# Altium project noise_toaster.PrjPcb (part 1 of 3)
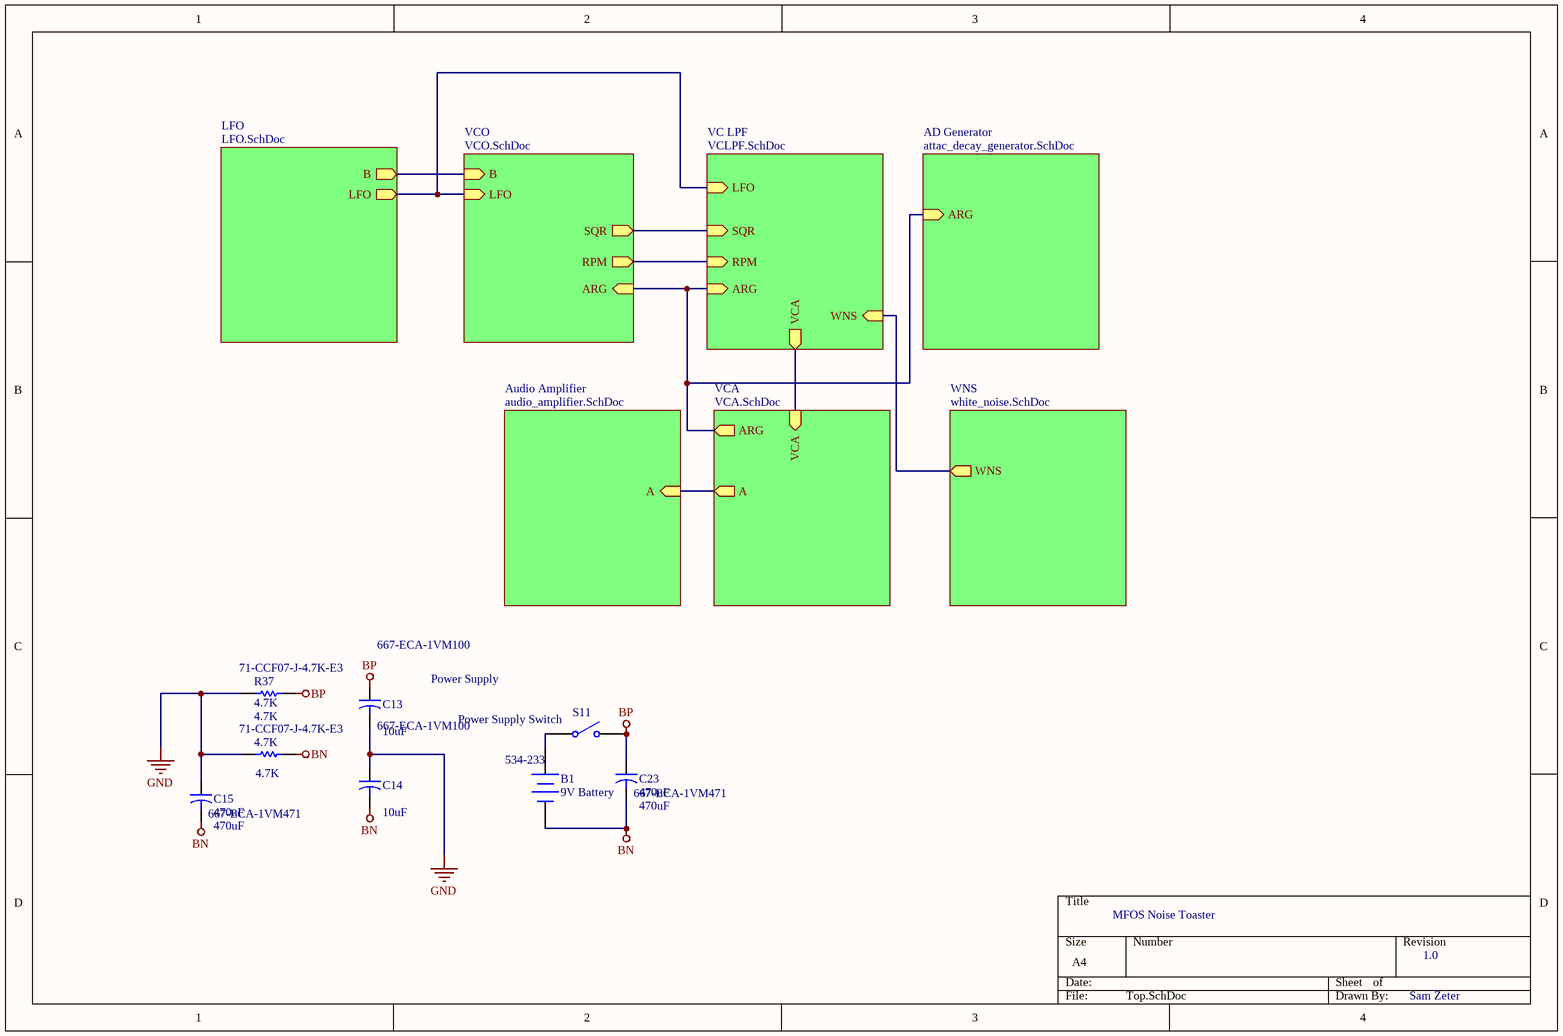
[diagram p0: Top.SchDoc]
8 sheets, 155 parts. Net scope: hierarchical (ports join the sheet entries above them; power ports are global).
Board file: main.PcbDoc
Sheets:
  Top.SchDoc
    VCO = VCO.SchDoc
    VCA = VCA.SchDoc
    VC LPF = VCLPF.SchDoc
    LFO = LFO.SchDoc
    AD Generator = attac_decay_generator.SchDoc
    Audio Amplifier = audio_amplifier.SchDoc
    WNS = white_noise.SchDoc

## Sheet Top.SchDoc
size A4

### Parts
4.7K  value 4.7K  Supplier Part Number 1: 71-CCF07-J-4.7K-E3  [AXIAL-0.3]  (hidden comment: Res1)
B1  9V Battery  Supplier Part Number 1: 534-233  [BAT-2]
C13  Supplier Part Number 1: 667-ECA-1VM100  [CAPR5-4X5]  (hidden comment: 10uF)
C14  Supplier Part Number 1: 667-ECA-1VM100  [CAPR5-4X5]  (hidden comment: 10uF)
C15  470uF  Supplier Part Number 1: 667-ECA-1VM471  [CAPR5-4X5]
C23  470uF  Supplier Part Number 1: 667-ECA-1VM471  [CAPR5-4X5]
R37  4.7K  Supplier Part Number 1: 71-CCF07-J-4.7K-E3  [AXIAL-0.3]
S11  Power Supply Switch  [SPST-2]

### Sub-sheets
AD Generator = attac_decay_generator.SchDoc: ARG (in)
Audio Amplifier = audio_amplifier.SchDoc: A (in)
LFO = LFO.SchDoc: LFO (out), B (out)
VC LPF = VCLPF.SchDoc: LFO (in), RPM (in), SQR (in), WNS (in), ARG (in), VCA (out)
VCA = VCA.SchDoc: VCA (in), A (out), ARG (out)
VCO = VCO.SchDoc: LFO (in), B (in), SQR (out), RPM (out), ARG (in)
WNS = white_noise.SchDoc: WNS (out)

### Nets
BN: 4.7K.2 B1.2(-) C14.2 C15.2 C23.2
BP: C13.1 C23.1 R37.2 S11.2(NO)
GND: 4.7K.1 C13.2 C14.1 C15.1 R37.1
NetB1_1: B1.1(+) S11.1(COMMON)
NetC2_1: sheet VCO/RPM, sheet VC LPF/RPM
NetC10_2: sheet VCA/VCA, sheet VC LPF/VCA
NetC17_2: sheet VCO/B, sheet LFO/B
NetQ6_3: sheet VC LPF/WNS, sheet WNS/WNS
NetQ7_2: sheet VCA/A, sheet Audio Amplifier/A
NetQ9_2: sheet VCO/ARG, sheet VCA/ARG, sheet VC LPF/ARG, sheet AD Generator/ARG
NetR13_1: sheet VCO/LFO, sheet VC LPF/LFO, sheet LFO/LFO
NetR31_2: sheet VCO/SQR, sheet VC LPF/SQR

### Notes on the sheet
- Power Supply
- MFOS Noise Toaster
- 1.0
- Sam Zeter

### Library data of the parts
4.7K R37 = Res1: Resistor; Manufacturer: Vishay / Dale; Manufacturer Part Number: CCF074K70JKE36; Power Rating: 250 mW (1/4 W), 500 mW (1/2 W); Resistance: 4.7 kOhms; Temperature Coefficient: 100 PPM / K; Tolerance: 5 %; Voltage Rating: 250 V; Lead Diameter: 0.6 mm; Published: 8-Jun-2000; LatestRevisionDate: 17-Jul-2002; LatestRevisionNote: Re-released for DXP Platform.; PackageReference: AXIAL-0.3; Publisher: Altium Limited; PackageDescription: Axial Device, Thru-Hole; 2 Leads; 0.3 in Pin Spacing; Supplier 1: Mouser; RoHS: RoHS Compliant; Category: Metal Film Resistors - Through Hole; Stock 1: 32326; Pricing 1: 1=0.100, 100=0.040, 1000=0.030, 2000=0.027, 5000=0.025, 10000=0.022, 25000=0.020, 50000=0.018, 100000=0.016 (USD); Diameter: 2.29 mm; Length: 6.22 mm; Operating Temperature Range: - 65 C to + 150 C; Packaging: Reel; Product: Metal Film Resistors - Through Hole; Series: CCF07; Termination Style: Axial; Type: Metal Film Resistors, Industrial; Brand: Vishay / Dale; Standard Pack Qty: 5000; RoHS - Mouser: Y; Minimum Order Quantity: 1; Reeling: True; ComponentLink1URL: http://www.mouser.com/ds/2/427/ccf07-239748.pdf; ComponentLink1Description: http://www.mouser.com/ds/2/427/ccf07-239748.pdf
  R37: Value: 4.7K
B1 = Battery: Multicell Battery; Manufacturer: Keystone Electronics; Manufacturer Part Number: 233; Number of Batteries: 1 Battery; Published: 24-Mar-1999; LatestRevisionDate: 17-Jul-2002; LatestRevisionNote: Re-released for DXP Platform.; PackageReference: BAT-2; Publisher: Altium Limited; PackageDescription: Battery; 2 Leads; Supplier 1: Mouser; RoHS: RoHS Compliant; Category: 9V Battery Snaps & Contacts; Stock 1: 3397; Pricing 1: 1=0.490, 10=0.467, 50=0.374, 100=0.358, 200=0.327, 500=0.312, 1000=0.259, 2500=0.234, 5000=0.226 (USD); Contact Plating: Nickel Plating; Material: Brass; Packaging: Bulk; Product: Battery Snaps; Type: Battery Strap; Battery Cell Size: 9 V; Brand: Keystone Electronics; Standard Pack Qty: 100; RoHS - Mouser: Y; Minimum Order Quantity: 1; Reeling: False; ComponentLink1URL: http://www.mouser.com/ds/2/215/32-234-741101.pdf; ComponentLink1Description: http://www.mouser.com/ds/2/215/32-234-741101.pdf
C13 C14 = Cap2: Capacitor; Manufacturer: Panasonic; Manufacturer Part Number: ECA-1VM100; Tolerance: 20 %; Type: Radial Lead Type; Voltage Rating DC: 35 VDC; Life: 2000 Hour; Ripple Current: 60 mA; Published: 23-Sep-2002; PackageReference: CAPR5-4X5; Publisher: Altium Limited; PackageDescription: Capacitor; 2 Leads; Value: 10uF; Supplier 1: Mouser; RoHS: RoHS Compliant; Category: Aluminum Electrolytic Capacitors - Leaded; Stock 1: 30530; Pricing 1: 1=0.200, 10=0.080, 100=0.055, 500=0.046, 1000=0.041, 2500=0.039, 10000=0.030, 25000=0.028, 50000=0.025 (USD); Capacitance: 10 uF; Diameter: 5 mm; Length: 11 mm; Package / Case: Radial, Can; Packaging: Bulk; Product: General Purpose Electrolytic Capacitors; Series: M; Termination Style: Radial; Brand: Panasonic; Lead Spacing: 2 mm; Lead Style: Straight; Maximum Operating Temperature: + 85 C; Minimum Operating Temperature: - 40 C; Standard Pack Qty: 200; RoHS - Mouser: Y; Minimum Order Quantity: 1; Reeling: False; ComponentLink1URL: http://www.mouser.com/ds/2/315/ABA0000C1047-947484.pdf; ComponentLink1Description: http://www.mouser.com/ds/2/315/ABA0000C1047-947484.pdf
C15 C23 = Cap2: Capacitor; Manufacturer: Panasonic; Manufacturer Part Number: ECA-1VM471; Tolerance: 20 %; Type: Radial Lead Type; Voltage Rating DC: 35 VDC; Dissipation Factor DF: 0.14; Life: 2000 Hour; Ripple Current: 550 mA; Published: 23-Sep-2002; PackageReference: CAPR5-4X5; Publisher: Altium Limited; PackageDescription: Capacitor; 2 Leads; Value: 470uF; Supplier 1: Mouser; RoHS: RoHS Compliant; Category: Aluminum Electrolytic Capacitors - Leaded; Stock 1: 25570; Pricing 1: 1=0.470, 10=0.252, 100=0.187, 500=0.162, 1000=0.138, 2500=0.130, 10000=0.112, 25000=0.110, 50000=0.104 (USD); Capacitance: 470 uF; Diameter: 10 mm; Length: 16 mm; Package / Case: Radial, Can; Packaging: Bulk; Product: General Purpose Electrolytic Capacitors; Series: M; Termination Style: Radial; Brand: Panasonic; Lead Spacing: 5 mm; Lead Style: Straight; Maximum Operating Temperature: + 85 C; Minimum Operating Temperature: - 40 C; Standard Pack Qty: 200; RoHS - Mouser: Y; Minimum Order Quantity: 1; Reeling: False; ComponentLink1URL: http://www.mouser.com/ds/2/315/ABA0000C1047-947484.pdf; ComponentLink1Description: http://www.mouser.com/ds/2/315/ABA0000C1047-947484.pdf
S11 = SW-SPST: Single-Pole, Single-Throw Switch; Published: 24-Mar-1999; LatestRevisionDate: 17-Jul-2002; LatestRevisionNote: Re-released for DXP Platform.; PackageReference: SPST-2; Publisher: Altium Limited; PackageDescription: Switch; 2 Leads; Supplier 1: Mouser; Supplier Part Number 1: 108-MS550K

## Sheet VCO.SchDoc
size A4
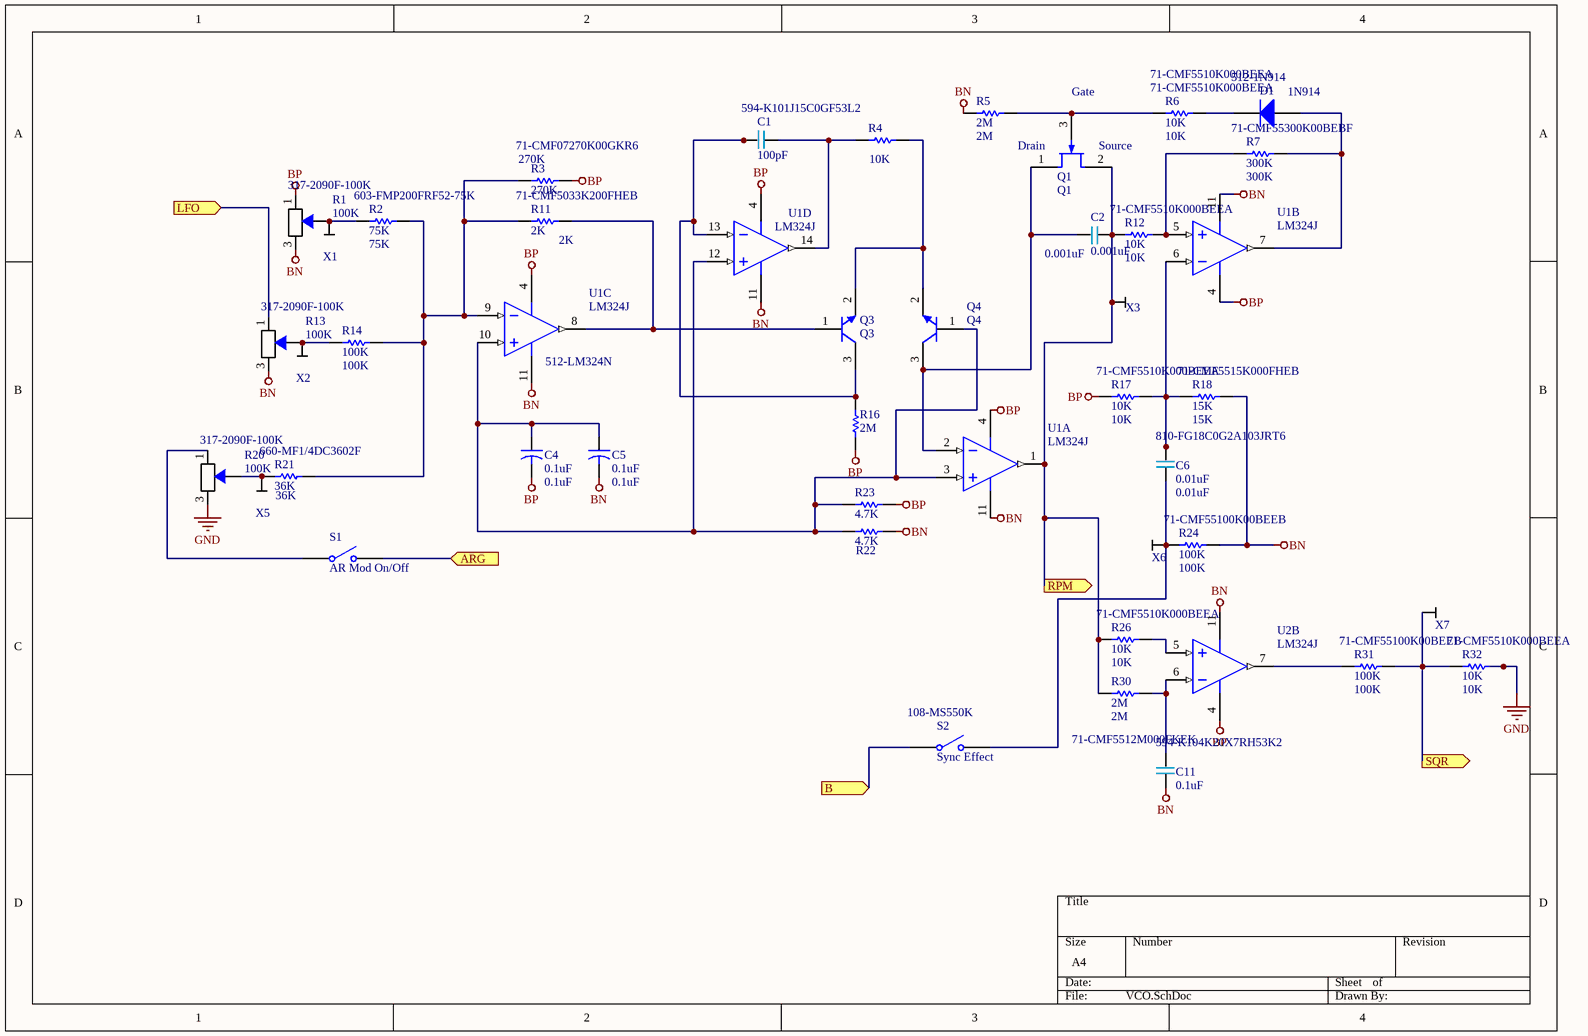
[diagram p1: VCO.SchDoc]

### Parts
C1  Supplier Part Number 1: 594-K101J15C0GF53L2  [Cap Film 5]  (hidden comment: 100pF)
C2  0.001uF  [Cap Film 5]
C4  0.1uF  [CAPR5-4X5]
C5  0.1uF  [CAPR5-4X5]
C6  0.01uF  Supplier Part Number 1: 810-FG18C0G2A103JRT6  [Cap Film 5]
C11  Supplier Part Number 1: 594-K104K20X7RH53K2  [Cap Film 5]  (hidden comment: 0.1uF)
D1  1N914  Supplier Part Number 1: 512-1N914  [DO-35]
Q1  Q1  [ONSC-SOT-23-3-318-08_V]
Q3  Q3  [ONSC-SC-75-3-463-01_V]
Q4  Q4  [ONSC-SC-75-3-463-01_V]
R1  Supplier Part Number 1: 317-2090F-100K  [Potentiometer]  (hidden comment: 100K)
R2  75K  Supplier Part Number 1: 603-FMP200FRF52-75K  [AXIAL-0.3]
R3  270K  Supplier Part Number 1: 71-CMF07270K00GKR6  [AXIAL-0.3]
R4  10K  [AXIAL-0.3]
R5  2M  [AXIAL-0.3]
R6  10K  Supplier Part Number 1: 71-CMF5510K000BEEA  [AXIAL-0.3]
R7  300K  Supplier Part Number 1: 71-CMF55300K00BEBF  [AXIAL-0.3]
R11  2K  Supplier Part Number 1: 71-CMF5033K200FHEB  [AXIAL-0.3]
R12  10K  Supplier Part Number 2: 71-CMF5510K000BEEA  [AXIAL-0.3]
R13  Supplier Part Number 1: 317-2090F-100K  [Potentiometer]  (hidden comment: 100K)
R14  100K  [AXIAL-0.3]
R16  2M  [AXIAL-0.3]
R17  10K  Supplier Part Number 2: 71-CMF5510K000BEEA  [AXIAL-0.3]
R18  15K  Supplier Part Number 1: 71-CMF5515K000FHEB  [AXIAL-0.3]
R20  value 100K  Supplier Part Number 1: 317-2090F-100K  [Potentiometer]  (hidden comment: Potentiometer)
R21  36K  Supplier Part Number 1: 660-MF1/4DC3602F  [AXIAL-0.3]
R22  4.7K  [AXIAL-0.3]
R23  4.7K  [AXIAL-0.3]
R24  100K  Supplier Part Number 2: 71-CMF55100K00BEEB  [AXIAL-0.3]
R26  10K  Supplier Part Number 2: 71-CMF5510K000BEEA  [AXIAL-0.3]
R30  2M  Supplier Part Number 1: 71-CMF5512M000FKEK  [AXIAL-0.3]
R31  100K  Supplier Part Number 2: 71-CMF55100K00BEEB  [AXIAL-0.3]
R32  10K  Supplier Part Number 2: 71-CMF5510K000BEEA  [AXIAL-0.3]
S1  AR Mod On/Off  [SPST-2]
S2  Sync Effect  Supplier Part Number 1: 108-MS550K  [SPST-2]
U1  LM324J  [J14A]  (parts A,B,C,D of 4)
U2  LM324J  [J14A]  (part B of 4)
X1  X1  [Pad]  (value not drawn)
X2  X2  [Pad]  (value not drawn)
X3  X3  [Pad]  (value not drawn)
X5  Pad  [Pad]  (value not drawn)
X6  X6  [Pad]  (value not drawn)
X7  X7  [Pad]  (value not drawn)

### Ports
ARG (in), B (in), LFO (in), RPM (out), SQR (out)

### Nets
BN: C5.2 C11.1 R1.3 R5.1 R13.3 R18.2 R22.1 R24.2 U1.11(GND) U2.11(GND)
BP: C4.2 R1.1 R3.2 R16.1 R17.1 R23.1 U1.4(V+) U2.4(V+)
GND: R20.3 R32.2
NetC1_1: C1.1 Q3.3(C) R16.2 U1.13(IN4-)
NetC1_2: C1.2 R4.1 U1.14(OUT4)
NetC2_1: C2.1 Q1.2(S) R12.1 R26.1 R30.1 U1.1(OUT1) X3.1 ; port RPM
NetC2_2: C2.2 Q1.1(D) Q4.3(C) U1.2(IN1-)
NetC4_1: C4.1 C5.1 Q4.1(B) R22.2 R23.2 U1.3(IN1+) U1.10(IN3+) U1.12(IN4+)
NetC6_1: C6.1 R24.1 S2.2(NO) X6.1
NetC6_2: C6.2 R17.2 R18.1 U1.6(IN2-)
NetC11_2: C11.2 R30.2 U2.6(IN2-)
NetC17_2: S2.1(COMMON) ; port B
NetD1_1: D1.1(A) R7.2 U1.7(OUT2)
NetD1_2: D1.2(K) R6.2
NetQ1_3: Q1.3(G) R5.2 R6.1
NetQ3_1: Q3.1(B) R11.2 U1.8(OUT3)
NetQ3_2: Q3.2(E) Q4.2(E) R4.2
NetQ9_2: S1.2(NO) ; port ARG
NetR1_2: R1.2 R2.1 X1.1
NetR2_2: R2.2 R3.1 R11.1 R14.2 R21.2 U1.9(IN3-)
NetR7_1: R7.1 R12.2 U1.5(IN2+)
NetR13_1: R13.1 ; port LFO
NetR13_2: R13.2 R14.1 X2.1
NetR20_1: R20.1 S1.1(COMMON)
NetR20_2: R20.2 R21.1 X5.1
NetR26_2: R26.2 U2.5(IN2+)
NetR31_1: R31.1 U2.7(OUT2)
NetR31_2: R31.2 R32.1 X7.1 ; port SQR

### Notes on the sheet
- (near Q1) Gate
- (near Q1) Drain
- (near Q1) Source

### Library data of the parts
C1 = Cap Film 5: Manufacturer: Vishay / BC Components; Manufacturer Part Number: K101J15C0GF53L2; Tolerance: 5 %; Type: Radial Leads; Voltage Rating: 50 V; Voltage Rating DC: 50 VDC; Case Style: Dipped; Capacitance - nF: 0.1 nF; Dielectric: C0G (NP0); Value: 100pF; Supplier 1: Mouser; RoHS: RoHS Compliant By Exemption; Category: Multilayer Ceramic Capacitors MLCC - Leaded; Stock 1: 11344; Pricing 1: 1=0.100, 50=0.060, 100=0.050, 1000=0.040, 5000=0.033, 10000=0.032, 15000=0.031, 25000=0.022 (USD); Capacitance: 100 pF; Height: 4 mm; Operating Temperature Range: - 55 C to + 125 C; Packaging: Bulk; Product: General Type MLCCs; Series: K; Termination Style: Radial; Width: 4 mm; Brand: Vishay / BC Components; Lead Spacing: 2.5 mm; Maximum Operating Temperature: + 125 C; Minimum Operating Temperature: - 55 C; Standard Pack Qty: 5000; Temperature Coefficient / Code: C0G (NP0); Tradename: Mono-Kap; RoHS - Mouser: E; Minimum Order Quantity: 1; Reeling: False; ComponentLink1URL: http://www.mouser.com/ds/2/427/kvseries-1097555.pdf; ComponentLink1Description: http://www.mouser.com/ds/2/427/kvseries-1097555.pdf
C2 = Cap Film 5: Value: 0.001uF; Supplier 1: Mouser; Supplier Part Number 1: 667-ECQ-E6102JF3
C4 C5 = Cap2: Capacitor; Published: 23-Sep-2002; PackageReference: CAPR5-4X5; Publisher: Altium Limited; PackageDescription: Capacitor; 2 Leads; Value: 0.1uF; Supplier 1: Mouser; Supplier Part Number 1: 594-K104K20X7RH53K2
C6 = Cap Film 5: Manufacturer: TDK; Manufacturer Part Number: FG18C0G2A103JRT06; Tolerance: 5 %; Type: Dipped Radial Multilayer Ceramic Capacitors; Voltage Rating: 100 V; Voltage Rating DC: 100 VDC; Case Style: Dipped; Capacitance - nF: 10 nF; Capacitance - pF: 10000 pF; Class: Class 1; Dielectric: C0G (NP0); Product Status: New Product; Value: 0.01uF; Supplier 1: Mouser; RoHS: RoHS Compliant; Category: Multilayer Ceramic Capacitors MLCC - Leaded; Stock 1: 5341; Pricing 1: 1=0.440, 10=0.385, 100=0.154, 500=0.140, 1000=0.126, 2000=0.093, 10000=0.085, 24000=0.081, 50000=0.072 (USD); Capacitance: 0.01 uF; Height: 2.5 mm; Length: 4 mm; Operating Temperature Range: - 55 C to + 125 C; Packaging: Reel; Product: General Type MLCCs; Series: FG; Termination Style: Radial; Width: 5.5 mm; Brand: TDK; Lead Spacing: 2.5 mm; Lead Style: Inside Bend; Maximum Operating Temperature: + 125 C; Minimum Operating Temperature: - 55 C; Standard Pack Qty: 2000; RoHS - Mouser: Y; Minimum Order Quantity: 1; Reeling: True; ComponentLink1URL: http://www.mouser.com/ds/2/400/eadmlcc_halogenfree_fg_en-775693.pdf; ComponentLink1Description: http://www.mouser.com/ds/2/400/eadmlcc_halogenfree_fg_en-775693.pdf
C11 = Cap Film 5: Manufacturer: Vishay / BC Components; Manufacturer Part Number: K104K20X7RH53K2; Tolerance: 10 %; Type: Radial Leads; Voltage Rating: 100 V; Voltage Rating DC: 100 VDC; Case Style: Dipped; Capacitance - nF: 100 nF; Capacitance - pF: 100000 pF; Dielectric: X7R; Lead Diameter: 0.5 mm; Value: 0.1uF; Supplier 1: Mouser; RoHS: RoHS Compliant By Exemption; Category: Multilayer Ceramic Capacitors MLCC - Leaded; Stock 1: 40614; Pricing 1: 1=0.380, 100=0.190, 300=0.160, 500=0.130, 1000=0.100, 2000=0.090, 11000=0.080, 23000=0.075 (USD); Capacitance: 0.1 uF; Height: 5 mm; Length: 5 mm; Operating Temperature Range: - 55 C to + 125 C; Packaging: Bulk; Product: General Type MLCCs; Series: K; Termination Style: Radial; Width: 5 mm; Brand: Vishay / BC Components; Lead Spacing: 2.5 mm; Lead Style: Outside Kink; Maximum Operating Temperature: + 125 C; Minimum Operating Temperature: - 55 C; Standard Pack Qty: 5000; Temperature Coefficient / Code: X7R; Tradename: Mono-Kap; RoHS - Mouser: E; Minimum Order Quantity: 1; Reeling: False; ComponentLink1URL: http://www.mouser.com/ds/2/427/kvseries-1097555.pdf; ComponentLink1Description: http://www.mouser.com/ds/2/427/kvseries-1097555.pdf
D1 = Diode 1N914: High Conductance Fast Diode; Published: 8-Jun-2000; LatestRevisionDate: 17-Jul-2002; LatestRevisionNote: Re-released for DXP Platform.; DatasheetVersion: 1997; PackageReference: DO-35; Publisher: Altium Limited; PackageDescription: Diode, Axial; Body 3.8 x 1.9 mm (LxDia. max), Lead Dia. 0.53 mm (max); Code_JEDEC: DO-204-AH; ComponentLink1Description: Manufacturer Link; ComponentLink1URL: http://www.fairchildsemi.com/; ComponentLink2Description: Datasheet; ComponentLink2URL: http://www.fairchildsemi.com/ds/1N%2F1N4448.pdf; Supplier 1: Mouser
Q1 = MMBF4391LT1: JFET Switching Transistor, N-Channel, 3-Pin SOT-23, Tape and Reel; Manufacturer: On Semiconductor; Channel Polarity: N Channel; Ciss Max (pF): 14; Crss Max (pF): 3.5; IDSS Max (uA): 150000; IDSS Min (uA): 50000; V(BR)GSS Min (V): 30; Vds - Drain-Source Breakdown Voltage: 30 V; DatasheetVersion: Rev. 10; PackageVersion: Rev. AP, 11/2009; PackageReference: SOT-23-3-318-08; PackageDescription: 3-Pin Small Outline Transistor, Body 2.92 x 1.3 mm, Pitch 0.95 mm; Supplier 1: Mouser; Supplier Part Number 1: 863-MMBF4391LT1G; Packing: Tape and Reel; Mounting Technology: Surface Mount; PartNumber: MMBF4391LT1; ComponentLink1Description: Manufacturer URL; ComponentLink1URL: http://www.onsemi.com/; ComponentLink2Description: Datasheet; ComponentLink2URL: http://www.onsemi.com/pub_link/Collateral/MMBF4391LT1-D.PDF; ComponentLink3Description: Package Specification; ComponentLink3URL: http://www.onsemi.cn/pub_link/Collateral/318-08.PDF; Supplier 2: Mouser; Supplier Part Number 2: 863-MMBF4391LT1G; Transistor Polarity: N-Channel
Q3 = MMBT3904TT1G: General Purpose Transistor, NPN Silicon, 3-Pin SC-75, Pb-Free, Tape and Reel; Manufacturer: On Semiconductor; fT Min (MHz): 300; IC Continuous (A): 0.2; DatasheetVersion: Rev. 5; PackageVersion: Rev. F, 07/2005; PackageReference: SC-75-3-463-01; PackageDescription: 3-Pin Small Outline Transistor, Body 1.6 x 0.8 mm, Pitch 0.5 mm; Supplier 1: Mouser; Supplier Part Number 1: 863-MMBT3904TT1G; Supplier 2: Digi-Key; Supplier Part Number 2: MMBT3904TT1GOSCT-ND; Supplier 3: Digi-Key; Supplier Part Number 3: MMBT3904TT1GOSDKR-ND; Supplier 4: Farnell; Supplier Part Number 4: 2317833; Supplier 5: Newark; Supplier Part Number 5: 88H4787; Supplier 6: Newark; Supplier Part Number 6: 85W3166; Supplier 7: Mouser; Supplier Part Number 7: 863-MMBT3904TT1G; Packing: Tape and Reel; Polarity: NPN; RoHS: TRUE; Mounting Technology: Surface Mount; PartNumber: MMBT3904TT1G; ComponentLink1Description: Manufacturer URL; ComponentLink1URL: http://www.onsemi.com/; ComponentLink2Description: Datasheet; ComponentLink2URL: http://www.onsemi.cn/pub_link/Collateral/MMBT3904TT1-D.PDF; ComponentLink3Description: Package Specification; ComponentLink3URL: http://www.onsemi.com/pub_link/Collateral/463-01.PDF
Q4 = MMBT3904TT1G: General Purpose Transistor, NPN Silicon, 3-Pin SC-75, Pb-Free, Tape and Reel; Manufacturer: On Semiconductor; fT Min (MHz): 300; IC Continuous (A): 0.2; Collector- Base Voltage VCBO: 60 V; Collector- Emitter Voltage VCEO Max: 40 V; Configuration: Single; Emitter- Base Voltage VEBO: 6 V; Collector-Emitter Saturation Voltage: 0.3 V; Continuous Collector Current: 0.2 A; DC Collector/Base Gain hfe Min: 40; Gain Bandwidth Product fT: 300 MHz; Pd - Power Dissipation: 225 mW; DatasheetVersion: Rev. 5; PackageVersion: Rev. F, 07/2005; PackageReference: SC-75-3-463-01; PackageDescription: 3-Pin Small Outline Transistor, Body 1.6 x 0.8 mm, Pitch 0.5 mm; Supplier 1: Mouser; Supplier Part Number 1: 863-MMBT3904TT1G; Supplier 2: Digi-Key; Supplier Part Number 2: MMBT3904TT1GOSCT-ND; Supplier 3: Digi-Key; Supplier Part Number 3: MMBT3904TT1GOSDKR-ND; Supplier 4: Farnell; Supplier Part Number 4: 2317833; Supplier 5: Newark; Supplier Part Number 5: 88H4787; Supplier 6: Newark; Supplier Part Number 6: 85W3166; Supplier 7: Mouser; Supplier Part Number 7: 863-MMBT3904TT1G; Packing: Tape and Reel; Polarity: NPN; RoHS: TRUE; Mounting Technology: Surface Mount; PartNumber: MMBT3904TT1G; ComponentLink1Description: Manufacturer URL; ComponentLink1URL: http://www.onsemi.com/; ComponentLink2Description: Datasheet; ComponentLink2URL: http://www.onsemi.cn/pub_link/Collateral/MMBT3904TT1-D.PDF; ComponentLink3Description: Package Specification; ComponentLink3URL: http://www.onsemi.com/pub_link/Collateral/463-01.PDF; Manufacturer Part Number: MMBT3904TT1G; Category: Bipolar Transistors - BJT; Stock 7: 46909; Pricing 7: 1=0.150, 10=0.130, 100=0.046, 1000=0.031, 3000=0.024, 9000=0.021, 24000=0.019, 45000=0.017, 99000=0.014 (USD); Height: 0.75 mm; Length: 1.6 mm; Package / Case: SC-75-3; Packaging: Reel; Series: MMBT3904T; Width: 0.8 mm; Brand: ON Semiconductor; Mounting Style: SMD/SMT; Transistor Polarity: NPN; Maximum DC Collector Current: 0.2 A; Maximum Operating Temperature: + 150 C; Minimum Operating Temperature: - 55 C; Standard Pack Qty: 3000; RoHS - Mouser: Y; Minimum Order Quantity: 1; Reeling: True; ComponentLink4URL: http://www.mouser.com/ds/2/308/MMBT3904TT1-D-80125.pdf; ComponentLink4Description: http://www.mouser.com/ds/2/308/MMBT3904TT1-D-80125.pdf
R1 R13 R20 = Potentiometer: My Own; Manufacturer: Alpha (Taiwan); Manufacturer Part Number: RV09AF-40-20K-B100K; Power Rating: 100 mW; Resistance: 100 kOhms; Tolerance: 20 %; Voltage Rating: 50 V; Number of Gangs: 1 Gang; Number of Turns: 1 Turn; Shaft Diameter: 6 mm; Shaft Length: 20 mm; Shaft Type: Knurled / Serrated; Supplier 1: Mouser; RoHS: RoHS Compliant; Category: Potentiometers; Stock 1: 13035; Pricing 1: 1=1.32, 25=1.11, 50=1.03, 100=0.940, 500=0.790, 1000=0.660, 2500=0.550, 5000=0.500, 10000=0.450 (USD); Operating Temperature Range: - 10 C to + 70 C; Product: Potentiometer; Termination Style: Through Hole; Type: Rotary; Brand: Alpha (Taiwan); Mounting Style: Panel Mount; Standard Pack Qty: 1000; Taper: Linear; RoHS - Mouser: Y; Minimum Order Quantity: 1; Reeling: False
  R1 R13: Value: 100K
R2 = Res1: Resistor; Manufacturer: Yageo; Manufacturer Part Number: FMP200FRF52-75K; Power Rating: 2 W; Resistance: 75 kOhms; Temperature Coefficient: 100 PPM / C; Tolerance: 1 %; Voltage Rating: 500 V; Published: 8-Jun-2000; LatestRevisionDate: 17-Jul-2002; LatestRevisionNote: Re-released for DXP Platform.; PackageReference: AXIAL-0.3; Publisher: Altium Limited; PackageDescription: Axial Device, Thru-Hole; 2 Leads; 0.3 in Pin Spacing; Value: 75K; Supplier 1: Mouser; RoHS: RoHS Compliant; Category: Metal Film Resistors - Through Hole; Stock 1: 6938; Pricing 1: 1=0.310, 10=0.192, 100=0.063, 1000=0.043, 2500=0.033, 10000=0.031, 25000=0.029, 100000=0.028 (USD); Diameter: 3.9 mm; Length: 9 mm; Operating Temperature Range: - 55 C to + 155 C; Packaging: Reel; Product: Metal Film Resistors General Purpose; Series: FMP; Termination Style: Axial; Type: High Power Type Ultra Miniature Style; Brand: Yageo; Standard Pack Qty: 2500; RoHS - Mouser: Y; Minimum Order Quantity: 1; Reeling: True; ComponentLink1URL: http://www.mouser.com/ds/2/447/Yageo LR_FMP_2013-594466.pdf; ComponentLink1Description: http://www.mouser.com/ds/2/447/Yageo LR_FMP_2013-594466.pdf
R3 = Res1: Resistor; Manufacturer: Vishay / Dale; Manufacturer Part Number: CMF07270K00GKR6; Power Rating: 500 mW (1/2 W); Resistance: 270 kOhms; Temperature Coefficient: 100 PPM / C; Tolerance: 2 %; Voltage Rating: 250 V; Lead Diameter: 0.64 mm; Published: 8-Jun-2000; LatestRevisionDate: 17-Jul-2002; LatestRevisionNote: Re-released for DXP Platform.; PackageReference: AXIAL-0.3; Publisher: Altium Limited; PackageDescription: Axial Device, Thru-Hole; 2 Leads; 0.3 in Pin Spacing; Value: 270K; Supplier 1: Mouser; RoHS: RoHS Compliant By Exemption; Category: Metal Film Resistors - Through Hole; Stock 1: 2501; Pricing 1: 1=0.160, 50=0.151, 100=0.130, 500=0.110, 1000=0.090, 2000=0.085, 5000=0.078, 10000=0.072, 25000=0.066 (USD); Diameter: 2.29 mm; Length: 6.1 mm; Operating Temperature Range: - 55 C to + 175 C; Packaging: Reel; Product: Metal Film Resistors Controlled Temp Coefficient; Series: CMF Industrial; Termination Style: Axial; Type: Metal Film Resistors, Industrial, Precision; Brand: Vishay / Dale; Standard Pack Qty: 1000; RoHS - Mouser: E; Minimum Order Quantity: 1; Reeling: True; ComponentLink1URL: http://www.mouser.com/ds/2/427/cmfind-239942.pdf; ComponentLink1Description: http://www.mouser.com/ds/2/427/cmfind-239942.pdf
R4 R12 R17 R26 R32 = Res1: Metal Film Resistors - Through Hole 1/4watt 10Kohms 5% Rated to 1/2watt; Manufacturer Part Number: CCF0710K0JKE36; Brand: Vishay / Dale; Lead Diameter: 0.6 mm; Power Rating: 250 mW (1/4 W), 500 mW (1/2 W); Temperature Coefficient: 100 PPM / K; Voltage Rating: 250 V; Published: 8-Jun-2000; LatestRevisionDate: 17-Jul-2002; LatestRevisionNote: Re-released for DXP Platform.; PackageReference: AXIAL-0.3; Publisher: Altium Limited; PackageDescription: Axial Device, Thru-Hole; 2 Leads; 0.3 in Pin Spacing; Value: 10K; Category: Metal Film Resistors - Through Hole; ComponentLink1Description: http://www.mouser.com/ds/2/427/ccf07-239748.pdf; ComponentLink1URL: http://www.mouser.com/ds/2/427/ccf07-239748.pdf; Diameter: 2.29 mm; Length: 6.22 mm; Manufacturer: Vishay / Dale; Minimum Order Quantity: 1; Operating Temperature Range: - 65 C to + 150 C; Packaging: Reel; Pricing 1: 1=0.100, 100=0.037, 1000=0.033, 2000=0.030, 5000=0.026, 10000=0.020, 25000=0.015, 50000=0.013, 100000=0.012 (USD); Product: Metal Film Resistors - Through Hole; Reeling: True; Resistance: 10 kOhms; RoHS - Mouser: Y; RoHS: RoHS Compliant; Series: CCF07; Standard Pack Qty: 5000; Stock 1: 48658; Supplier 1: Mouser; Termination Style: Axial; Tolerance: 5 %; Type: Metal Film Resistors, Industrial
  R4: Supplier Part Number 1: 71-CCF0710K0JKE36
  R12 R17 R26 R32: Supplier Part Number 1: 71-CMF5510K000BEEA; Supplier 2: Mouser; Stock 2: 4124; Pricing 2: 1=0.610, 5000=0.249, 10000=0.242, 20000=0.236, 50000=0.234 (USD); ComponentLink2URL: http://www.mouser.com/ds/2/427/cmfind-239942.pdf; ComponentLink2Description: http://www.mouser.com/ds/2/427/cmfind-239942.pdf
R5 R16 = Res1: Resistor; Manufacturer Part Number: CMF5512M000FKEK; Published: 8-Jun-2000; LatestRevisionDate: 17-Jul-2002; LatestRevisionNote: Re-released for DXP Platform.; PackageReference: AXIAL-0.3; Publisher: Altium Limited; PackageDescription: Axial Device, Thru-Hole; 2 Leads; 0.3 in Pin Spacing; Value: 2M; Supplier 1: Mouser; Supplier Part Number 1: 71-CMF5512M000FKEK
R6 = Res1: Resistor; Manufacturer: Vishay / Dale; Manufacturer Part Number: CCF0710K0JKE36; Power Rating: 250 mW (1/4 W), 500 mW (1/2 W); Resistance: 10 kOhms; Temperature Coefficient: 100 PPM / K; Tolerance: 5 %; Voltage Rating: 250 V; Lead Diameter: 0.6 mm; Published: 8-Jun-2000; LatestRevisionDate: 17-Jul-2002; LatestRevisionNote: Re-released for DXP Platform.; PackageReference: AXIAL-0.3; Publisher: Altium Limited; PackageDescription: Axial Device, Thru-Hole; 2 Leads; 0.3 in Pin Spacing; Value: 10K; Supplier 1: Mouser; RoHS: RoHS Compliant; Category: Metal Film Resistors - Through Hole; Stock 1: 48658; Pricing 1: 1=0.100, 100=0.037, 1000=0.033, 2000=0.030, 5000=0.026, 10000=0.020, 25000=0.015, 50000=0.013, 100000=0.012 (USD); Diameter: 2.29 mm; Length: 6.22 mm; Operating Temperature Range: - 65 C to + 150 C; Packaging: Reel; Product: Metal Film Resistors - Through Hole; Series: CCF07; Termination Style: Axial; Type: Metal Film Resistors, Industrial; Brand: Vishay / Dale; Standard Pack Qty: 5000; RoHS - Mouser: Y; Minimum Order Quantity: 1; Reeling: True; ComponentLink1URL: http://www.mouser.com/ds/2/427/ccf07-239748.pdf; ComponentLink1Description: http://www.mouser.com/ds/2/427/ccf07-239748.pdf; Supplier Part Number 2: 71-CMF5510K000BEEA; Stock 2: 4124; Pricing 2: 1=0.610, 5000=0.249, 10000=0.242, 20000=0.236, 50000=0.234 (USD); ComponentLink2URL: http://www.mouser.com/ds/2/427/cmfind-239942.pdf; ComponentLink2Description: http://www.mouser.com/ds/2/427/cmfind-239942.pdf
R7 = Res1: Resistor; Manufacturer: Vishay / Dale; Manufacturer Part Number: CMF55300K00BEBF; Power Rating: 500 mW (1/2 W); Resistance: 300 kOhms; Temperature Coefficient: 25 PPM / C; Tolerance: 0.1 %; Voltage Rating: 250 V; Lead Diameter: 0.64 mm; Published: 8-Jun-2000; LatestRevisionDate: 17-Jul-2002; LatestRevisionNote: Re-released for DXP Platform.; PackageReference: AXIAL-0.3; Publisher: Altium Limited; PackageDescription: Axial Device, Thru-Hole; 2 Leads; 0.3 in Pin Spacing; Value: 300K; Supplier 1: Mouser; RoHS: No; Category: Metal Film Resistors - Through Hole; Stock 1: 893; Pricing 1: 1=0.590, 100=0.571, 300=0.561, 500=0.551, 1000=0.515, 2000=0.500, 11000=0.430, 23000=0.400 (USD); Diameter: 2.29 mm; Length: 6.1 mm; Operating Temperature Range: - 55 C to + 175 C; Packaging: Bulk; Product: Metal Film Resistors Controlled Temp Coefficient; Series: CMF Industrial; Termination Style: Axial; Type: Metal Film Resistors, Industrial, Precision; Brand: Vishay / Dale; Standard Pack Qty: 100; RoHS - Mouser: N; Minimum Order Quantity: 1; Reeling: False; ComponentLink1URL: http://www.mouser.com/ds/2/427/cmfind-239942.pdf; ComponentLink1Description: http://www.mouser.com/ds/2/427/cmfind-239942.pdf
R11 = Res1: Resistor; Manufacturer: Vishay / Dale; Manufacturer Part Number: CMF5033K200FHEB; Power Rating: 250 mW (1/4 W); Resistance: 33.2 kOhms; Temperature Coefficient: 50 PPM / C; Tolerance: 1 %; Voltage Rating: 200 V; Lead Diameter: 0.41 mm; Published: 8-Jun-2000; LatestRevisionDate: 17-Jul-2002; LatestRevisionNote: Re-released for DXP Platform.; PackageReference: AXIAL-0.3; Publisher: Altium Limited; PackageDescription: Axial Device, Thru-Hole; 2 Leads; 0.3 in Pin Spacing; Value: 2K; Supplier 1: Mouser; RoHS: RoHS Compliant; Category: Metal Film Resistors - Through Hole; Stock 1: 1365; Pricing 1: 1=0.390, 50=0.338, 100=0.278, 500=0.242, 1000=0.217, 2000=0.193, 5000=0.187, 10000=0.181, 25000=0.175 (USD); Diameter: 1.65 mm; Length: 3.81 mm; Operating Temperature Range: - 55 C to + 175 C; Packaging: Reel; Product: Metal Film Resistors Controlled Temp Coefficient; Series: CMF Industrial; Termination Style: Axial; Type: Metal Film Resistors, Industrial, Precision; Brand: Vishay / Dale; Standard Pack Qty: 1000; RoHS - Mouser: Y; Minimum Order Quantity: 1; Reeling: True; ComponentLink1URL: http://www.mouser.com/ds/2/427/cmfind-239942.pdf; ComponentLink1Description: http://www.mouser.com/ds/2/427/cmfind-239942.pdf
R14 R24 R31 = Res1: Resistor; Manufacturer Part Number: CMF55100K00FHEK; Brand: Vishay / Dale; Lead Diameter: 0.64 mm; Power Rating: 500 mW (1/2 W); Resistance: 100 kOhms; Temperature Coefficient: 50 PPM / C; Tolerance: 1 %; Voltage Rating: 250 V; Value: 100K; Published: 8-Jun-2000; LatestRevisionDate: 17-Jul-2002; LatestRevisionNote: Re-released for DXP Platform.; PackageReference: AXIAL-0.3; Publisher: Altium Limited; PackageDescription: Axial Device, Thru-Hole; 2 Leads; 0.3 in Pin Spacing; Category: Metal Film Resistors - Through Hole; ComponentLink1Description: http://www.mouser.com/ds/2/427/cmfind-239942.pdf; ComponentLink1URL: http://www.mouser.com/ds/2/427/cmfind-239942.pdf; Diameter: 2.29 mm; Length: 6.1 mm; Manufacturer: Vishay / Dale; Minimum Order Quantity: 1; Operating Temperature Range: - 55 C to + 175 C; Packaging: Bulk; Pricing 1: 1=0.230, 25=0.181, 100=0.132, 500=0.115, 1000=0.099, 2000=0.092, 5000=0.087, 10000=0.082, 25000=0.072 (USD); Product: Metal Film Resistors Controlled Temp Coefficient; Reeling: False; RoHS - Mouser: Y; RoHS: RoHS Compliant; Series: CMF Industrial; Standard Pack Qty: 100; Stock 1: 4041; Supplier 1: Mouser; Termination Style: Axial; Type: Metal Film Resistors, Industrial, Precision
  R14: Supplier Part Number 1: 71-CMF55100K00FHEK; Supplier Part Number 2: 71-CMF55100K00BEEB
  R24 R31: Supplier Part Number 1: 71-CMF55100K00BEEB; Stock 2: 1499; Pricing 2: 1=0.710, 50=0.650, 100=0.491, 500=0.408, 1000=0.302, 2000=0.294, 5000=0.288, 10000=0.279, 25000=0.272 (USD)
R18 = Res1: Resistor; Manufacturer: Vishay / Dale; Manufacturer Part Number: CMF5515K000FHEB; Power Rating: 500 mW (1/2 W); Resistance: 15 kOhms; Temperature Coefficient: 50 PPM / C; Tolerance: 1 %; Voltage Rating: 250 V; Lead Diameter: 0.64 mm; Published: 8-Jun-2000; LatestRevisionDate: 17-Jul-2002; LatestRevisionNote: Re-released for DXP Platform.; PackageReference: AXIAL-0.3; Publisher: Altium Limited; PackageDescription: Axial Device, Thru-Hole; 2 Leads; 0.3 in Pin Spacing; Value: 15K; Supplier 1: Mouser; RoHS: RoHS Compliant; Category: Metal Film Resistors - Through Hole; Stock 1: 2476; Pricing 1: 1=0.350, 50=0.266, 100=0.168, 500=0.144, 1000=0.100, 2000=0.093, 5000=0.084, 10000=0.082, 25000=0.080 (USD); Diameter: 2.29 mm; Length: 6.1 mm; Operating Temperature Range: - 55 C to + 175 C; Packaging: Reel; Product: Metal Film Resistors Controlled Temp Coefficient; Series: CMF Industrial; Termination Style: Axial; Type: Metal Film Resistors, Industrial, Precision; Brand: Vishay / Dale; Standard Pack Qty: 1000; RoHS - Mouser: Y; Minimum Order Quantity: 1; Reeling: True; ComponentLink1URL: http://www.mouser.com/ds/2/427/cmfind-239942.pdf; ComponentLink1Description: http://www.mouser.com/ds/2/427/cmfind-239942.pdf
R21 = Res1: Resistor; Manufacturer: KOA Speer; Manufacturer Part Number: MF1/4DC3602F; Power Rating: 250 mW (1/4 W); Resistance: 36 kOhms; Temperature Coefficient: 100 PPM / C; Tolerance: 1 %; Voltage Rating: 500 V; Value: 36K; Published: 8-Jun-2000; LatestRevisionDate: 17-Jul-2002; LatestRevisionNote: Re-released for DXP Platform.; PackageReference: AXIAL-0.3; Publisher: Altium Limited; PackageDescription: Axial Device, Thru-Hole; 2 Leads; 0.3 in Pin Spacing; Supplier 1: Mouser; RoHS: RoHS Compliant; Category: Metal Film Resistors - Through Hole; Stock 1: 7576; Pricing 1: 1=0.230, 10=0.055, 100=0.019, 1000=0.014, 2000=0.009, 10000=0.008, 25000=0.007, 50000=0.006 (USD); Diameter: 2.3 mm; Length: 7.1 mm; Operating Temperature Range: - 55 C to + 155 C; Packaging: Bulk; Product: Metal Film Resistors General Purpose; Series: MF; Termination Style: Axial; Type: Semi-precision metal film resistors; Brand: KOA Speer; Lead Spacing: 30 mm; Standard Pack Qty: 1000; RoHS - Mouser: Y; Minimum Order Quantity: 1; Reeling: False; ComponentLink1URL: http://www.mouser.com/ds/2/219/MF-MFS-RK-18760.pdf; ComponentLink1Description: http://www.mouser.com/ds/2/219/MF-MFS-RK-18760.pdf
R22 R23 = Res1: Resistor; Manufacturer Part Number: CCF074K70JKE36; Brand: Vishay / Dale; Lead Diameter: 0.6 mm; Power Rating: 250 mW (1/4 W), 500 mW (1/2 W); Resistance: 4.7 kOhms; Temperature Coefficient: 100 PPM / K; Tolerance: 5 %; Voltage Rating: 250 V; Published: 8-Jun-2000; LatestRevisionDate: 17-Jul-2002; LatestRevisionNote: Re-released for DXP Platform.; PackageReference: AXIAL-0.3; Publisher: Altium Limited; PackageDescription: Axial Device, Thru-Hole; 2 Leads; 0.3 in Pin Spacing; Value: 4.7K; Category: Metal Film Resistors - Through Hole; ComponentLink1Description: http://www.mouser.com/ds/2/427/ccf07-239748.pdf; ComponentLink1URL: http://www.mouser.com/ds/2/427/ccf07-239748.pdf; Diameter: 2.29 mm; Length: 6.22 mm; Manufacturer: Vishay / Dale; Minimum Order Quantity: 1; Operating Temperature Range: - 65 C to + 150 C; Packaging: Reel; Pricing 1: 1=0.100, 100=0.040, 1000=0.030, 2000=0.027, 5000=0.025, 10000=0.022, 25000=0.020, 50000=0.018, 100000=0.016 (USD); Product: Metal Film Resistors - Through Hole; Reeling: True; RoHS - Mouser: Y; RoHS: RoHS Compliant; Series: CCF07; Standard Pack Qty: 5000; Stock 1: 32326; Supplier 1: Mouser; Supplier Part Number 1: 71-CCF07-J-4.7K-E3; Termination Style: Axial; Type: Metal Film Resistors, Industrial
R30 = Res1: Resistor; Manufacturer: Vishay / Dale; Manufacturer Part Number: CMF5512M000FKEK; Power Rating: 500 mW; Resistance: 12 MOhms; Temperature Coefficient: 100 PPM / C; Tolerance: 1 %; Voltage Rating: 250 V; Product Status: New at Mouser; Published: 8-Jun-2000; LatestRevisionDate: 17-Jul-2002; LatestRevisionNote: Re-released for DXP Platform.; PackageReference: AXIAL-0.3; Publisher: Altium Limited; PackageDescription: Axial Device, Thru-Hole; 2 Leads; 0.3 in Pin Spacing; Value: 2M; Supplier 1: Mouser; RoHS: RoHS Compliant; Category: Metal Film Resistors - Through Hole; Stock 1: 94; Pricing 1: 1=1.59, 5=1.47, 10=1.40, 25=1.27, 50=1.21, 100=1.15, 200=0.990, 500=0.960, 1000=0.920 (USD); Diameter: 2.29 mm; Length: 6.1 mm; Operating Temperature Range: - 55 C to + 175 C; Packaging: Bulk; Product: Metal Film Resistors Controlled Temp Coefficient; Series: CMF Industrial; Termination Style: Axial; Type: Metal Film Resistors, Industrial, Precision; Brand: Vishay / Dale; Maximum Operating Temperature: + 175 C; Minimum Operating Temperature: - 55 C; Standard Pack Qty: 100; RoHS - Mouser: Y; Minimum Order Quantity: 1; Reeling: False; ComponentLink1URL: http://www.mouser.com/ds/2/427/cmfind-239942.pdf; ComponentLink1Description: http://www.mouser.com/ds/2/427/cmfind-239942.pdf
S1 = SW-SPST: Single-Pole, Single-Throw Switch; Published: 24-Mar-1999; LatestRevisionDate: 17-Jul-2002; LatestRevisionNote: Re-released for DXP Platform.; PackageReference: SPST-2; Publisher: Altium Limited; PackageDescription: Switch; 2 Leads; Supplier 1: Mouser; Supplier Part Number 1: 108-MS550K
S2 = SW-SPST: Single-Pole, Single-Throw Switch; Manufacturer: Mountain Switch; Actuator: Paddle; Bushing Size: M6; Contact Form: SPST; Switch Function: ON - OFF; Voltage Rating AC: 125 VAC; Published: 24-Mar-1999; LatestRevisionDate: 17-Jul-2002; LatestRevisionNote: Re-released for DXP Platform.; PackageReference: SPST-2; Publisher: Altium Limited; PackageDescription: Switch; 2 Leads; Supplier 1: Mouser; Manufacturer Part Number: 108-MS550K; RoHS: No; Category: Toggle Switches; Stock 1: 433; Pricing 1: 1=2.10, 50=2.04, 100=1.97, 500=1.92, 1000=1.74, 2000=1.65, 5000=1.58 (USD); Contact Plating: Gold; Mounting Type: Bushing; Packaging: Bulk; Series: 108; Terminal Seal: Sealed; Termination Style: Solder Lug; Type: Toggle Switches; Brand: Mountain Switch; Contact Material: Nickel; Mounting Style: Panel; Standard Pack Qty: 100; RoHS - Mouser: N; Minimum Order Quantity: 1; Reeling: False; ComponentLink1URL: http://www.mouser.com/ds/2/221/MS-200272-200731.pdf; ComponentLink1Description: http://www.mouser.com/ds/2/221/MS-200272-200731.pdf
U1 U2 = LM324J: Low Power Quad Operational Amplifier, 14-pin CerDIP; Manufacturer: National Semiconductor; PackageTopMarking: NSUZXYYTT*LM324J; PowerWise: N; CompType: Amplifiers; High-Reliability: Y; DatasheetVersion: Aug-2000; PackageVersion: revJ, Jul-2002; PackageReference: J14A; PackageDescription: Cerdip, .400 x .310in Body, 14 Lead, .300in Centers, .100in Pitch; PartNumber: LM324J; RoHS: N; PinCount: 14; ComponentLink1Description: Manufacturer URL; ComponentLink1URL: http://www.national.com/; ComponentLink2Description: LM324 Datasheet; ComponentLink2URL: http://www.national.com/ds/LM/LM324.pdf; ComponentLink3Description: LM324 Web Page; ComponentLink3URL: http://www.national.com/pf/LM/LM324.html; ComponentLink4Description: J14A Package Page; ComponentLink4URL: http://www.national.com/packaging/folders/j14a.html; Supplier 1: Mouser; Supplier Part Number 1: 512-LM324N
X1-X3 X6 X7 = Pad

## Sheet VCA.SchDoc
size A4
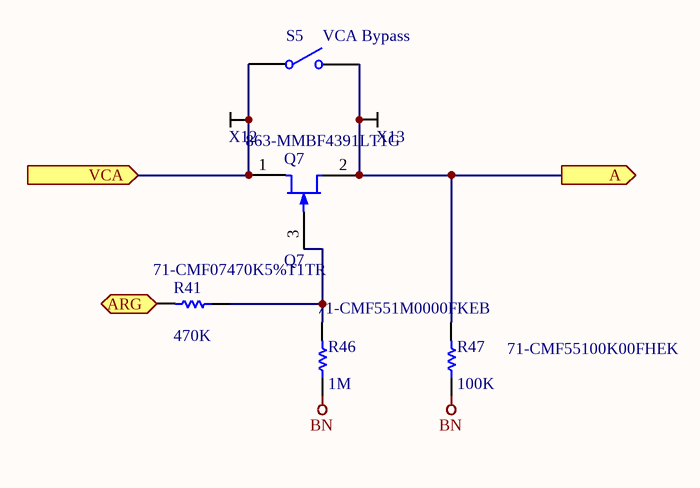
[diagram p2: VCA.SchDoc]

### Parts
Q7  Q7  Supplier Part Number 2: 863-MMBF4391LT1G  [ONSC-SOT-23-3-318-08_V]
R41  Supplier Part Number 1: 71-CMF07470K5%T1TR  [AXIAL-0.3]  (hidden comment: 470K)
R46  Supplier Part Number 1: 71-CMF551M0000FKEB  [AXIAL-0.3]  (hidden comment: 1M)
R47  Supplier Part Number 1: 71-CMF55100K00FHEK  [AXIAL-0.3]  (hidden comment: 100K)
S5  VCA Bypass  [SPST-2]
X12  X12  [Pad]  (value not drawn)
X13  X13  [Pad]  (value not drawn)

### Ports
A (out), ARG (out), VCA (in)

### Nets
BN: R46.1 R47.1
NetC10_2: Q7.1(D) S5.1(COMMON) X12.1 ; port VCA
NetQ7_2: Q7.2(S) R47.2 S5.2(NO) X13.1 ; port A
NetQ7_3: Q7.3(G) R41.1 R46.2
NetQ9_2: R41.2 ; port ARG

### Library data of the parts
Q7 = MMBF4391LT1: JFET Switching Transistor, N-Channel, 3-Pin SOT-23, Tape and Reel; Manufacturer: On Semiconductor; Manufacturer Part Number: MMBF4391LT1G; Channel Polarity: N Channel; Ciss Max (pF): 14; Crss Max (pF): 3.5; IDSS Max (uA): 150000; IDSS Min (uA): 50000; V(BR)GSS Min (V): 30; Configuration: Single; Drain-Source Current at Vgs=0: 50 mA to 150 mA; Vds - Drain-Source Breakdown Voltage: 30 V; DatasheetVersion: Rev. 10; PackageVersion: Rev. AP, 11/2009; PackageReference: SOT-23-3-318-08; PackageDescription: 3-Pin Small Outline Transistor, Body 2.92 x 1.3 mm, Pitch 0.95 mm; Supplier 1: Mouser; Supplier Part Number 1: 863-MMBF4391LT1G; Packing: Tape and Reel; Mounting Technology: Surface Mount; PartNumber: MMBF4391LT1; ComponentLink1Description: Manufacturer URL; ComponentLink1URL: http://www.onsemi.com/; ComponentLink2Description: Datasheet; ComponentLink2URL: http://www.onsemi.com/pub_link/Collateral/MMBF4391LT1-D.PDF; ComponentLink3Description: Package Specification; ComponentLink3URL: http://www.onsemi.cn/pub_link/Collateral/318-08.PDF; Supplier 2: Mouser; RoHS: RoHS Compliant; Category: JFET; Stock 2: 3330; Pricing 2: 1=0.490, 10=0.339, 100=0.156, 1000=0.120, 3000=0.102, 9000=0.093, 24000=0.087, 45000=0.078, 99000=0.075 (USD); Package / Case: SOT-23-3; Packaging: Reel; Series: MMBF4391L; Brand: ON Semiconductor; Mounting Style: SMD/SMT; Transistor Polarity: N-Channel; Standard Pack Qty: 3000; Vgs - Gate-Source Breakdown Voltage: 30 V; RoHS - Mouser: Y; Minimum Order Quantity: 1; Reeling: True; ComponentLink4URL: http://www.mouser.com/ds/2/308/MMBF4391LT1-D-108578.pdf; ComponentLink4Description: http://www.mouser.com/ds/2/308/MMBF4391LT1-D-108578.pdf
R41 = Res1: Resistor; Manufacturer: Vishay / Dale; Manufacturer Part Number: CMF07470K00JKR6; Power Rating: 500 mW (1/2 W); Resistance: 470 kOhms; Temperature Coefficient: 100 PPM / C; Tolerance: 5 %; Voltage Rating: 250 V; Lead Diameter: 0.64 mm; Published: 8-Jun-2000; LatestRevisionDate: 17-Jul-2002; LatestRevisionNote: Re-released for DXP Platform.; PackageReference: AXIAL-0.3; Publisher: Altium Limited; PackageDescription: Axial Device, Thru-Hole; 2 Leads; 0.3 in Pin Spacing; Value: 470K; Supplier 1: Mouser; RoHS: No; Category: Metal Film Resistors - Through Hole; Stock 1: 1018; Pricing 1: 1=0.160, 1000=0.160, 2000=0.085, 4000=0.078, 10000=0.072, 20000=0.066 (USD); Diameter: 2.29 mm; Length: 6.1 mm; Operating Temperature Range: - 55 C to + 175 C; Packaging: Reel; Product: Metal Film Resistors Controlled Temp Coefficient; Series: CMF Industrial; Termination Style: Axial; Type: Metal Film Resistors, Industrial, Precision; Brand: Vishay / Dale; Standard Pack Qty: 1000; RoHS - Mouser: N; Minimum Order Quantity: 1; Reeling: True; ComponentLink1URL: http://www.mouser.com/ds/2/427/cmfind-239942.pdf; ComponentLink1Description: http://www.mouser.com/ds/2/427/cmfind-239942.pdf
R46 = Res1: Resistor; Manufacturer: Vishay / Dale; Manufacturer Part Number: CMF551M0000FKEB; Power Rating: 500 mW (1/2 W); Resistance: 1 MOhms; Temperature Coefficient: 100 PPM / C; Tolerance: 1 %; Voltage Rating: 250 V; Lead Diameter: 0.64 mm; Published: 8-Jun-2000; LatestRevisionDate: 17-Jul-2002; LatestRevisionNote: Re-released for DXP Platform.; PackageReference: AXIAL-0.3; Publisher: Altium Limited; PackageDescription: Axial Device, Thru-Hole; 2 Leads; 0.3 in Pin Spacing; Value: 1M; Supplier 1: Mouser; RoHS: RoHS Compliant; Category: Metal Film Resistors - Through Hole; Stock 1: 2620; Pricing 1: 1=0.310, 50=0.232, 100=0.146, 500=0.125, 1000=0.087, 2000=0.081, 5000=0.073, 10000=0.072, 25000=0.069 (USD); Diameter: 2.29 mm; Length: 6.1 mm; Operating Temperature Range: - 55 C to + 175 C; Packaging: Reel; Product: Metal Film Resistors Controlled Temp Coefficient; Series: CMF Industrial; Termination Style: Axial; Type: Metal Film Resistors, Industrial, Precision; Brand: Vishay / Dale; Standard Pack Qty: 1000; RoHS - Mouser: Y; Minimum Order Quantity: 1; Reeling: True; ComponentLink1URL: http://www.mouser.com/ds/2/427/cmfind-239942.pdf; ComponentLink1Description: http://www.mouser.com/ds/2/427/cmfind-239942.pdf
R47 = Res1: Resistor; Manufacturer: Vishay / Dale; Manufacturer Part Number: CMF55100K00FHEK; Power Rating: 500 mW (1/2 W); Resistance: 100 kOhms; Temperature Coefficient: 50 PPM / C; Tolerance: 1 %; Voltage Rating: 250 V; Lead Diameter: 0.64 mm; Published: 8-Jun-2000; LatestRevisionDate: 17-Jul-2002; LatestRevisionNote: Re-released for DXP Platform.; PackageReference: AXIAL-0.3; Publisher: Altium Limited; PackageDescription: Axial Device, Thru-Hole; 2 Leads; 0.3 in Pin Spacing; Value: 100K; Supplier 1: Mouser; RoHS: RoHS Compliant; Category: Metal Film Resistors - Through Hole; Stock 1: 4041; Pricing 1: 1=0.230, 25=0.181, 100=0.132, 500=0.115, 1000=0.099, 2000=0.092, 5000=0.087, 10000=0.082, 25000=0.072 (USD); Diameter: 2.29 mm; Length: 6.1 mm; Operating Temperature Range: - 55 C to + 175 C; Packaging: Bulk; Product: Metal Film Resistors Controlled Temp Coefficient; Series: CMF Industrial; Termination Style: Axial; Type: Metal Film Resistors, Industrial, Precision; Brand: Vishay / Dale; Standard Pack Qty: 100; RoHS - Mouser: Y; Minimum Order Quantity: 1; Reeling: False; ComponentLink1URL: http://www.mouser.com/ds/2/427/cmfind-239942.pdf; ComponentLink1Description: http://www.mouser.com/ds/2/427/cmfind-239942.pdf; Supplier Part Number 2: 71-CMF55100K00BEEB
S5 = SW-SPST: Single-Pole, Single-Throw Switch; Published: 24-Mar-1999; LatestRevisionDate: 17-Jul-2002; LatestRevisionNote: Re-released for DXP Platform.; PackageReference: SPST-2; Publisher: Altium Limited; PackageDescription: Switch; 2 Leads; Supplier 1: Mouser; Supplier Part Number 1: 108-MS550K
X12 X13 = Pad